# EAGLE design JDM2_2-Voltage_JmpConf_VDDctrl_LED (EAGLE 7.7.0)
JDM2 with selectable Dual-Voltage
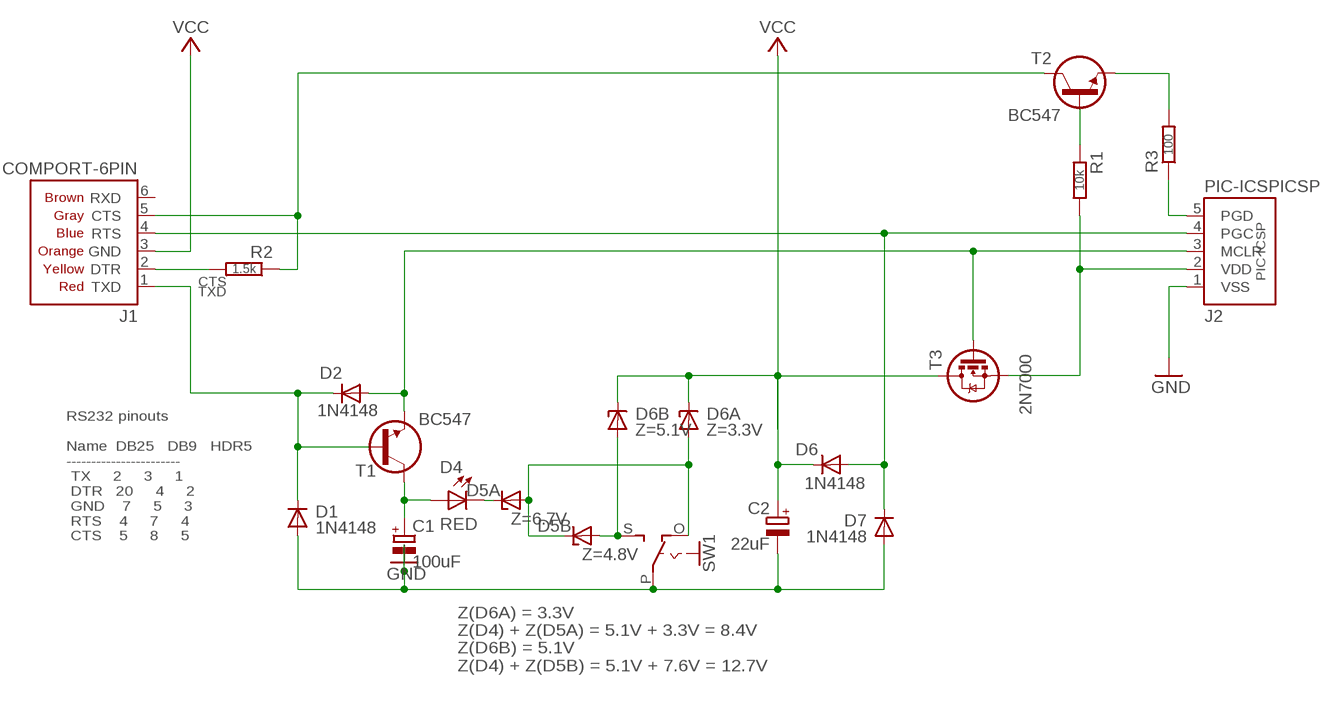
[diagram p0: schematic, sheet 1]

## Parts
C1  100uF  CPOLE2,5-5/V  [E2,5-5/V]
C2  22uF  CPOLE2,5-4/V  [E2.5-4/V]
D1  1N4148  1N414834-5  [DO34-5]
D2  1N4148  1N414834-5  [DO34-5]
D4  RED  TLLR4400  [LED3MM]
D5A  Z=6.7V  Z-DIODE34Z7  [DO34Z7]
D5B  Z=4.8V  Z-DIODE34Z7  [DO34Z7]
D6  1N4148  1N414834-10V  [DO34-10V]
D6A  Z=3.3V  Z-DIODE34Z7V  [DO34Z7V]
D6B  Z=5.1V  Z-DIODE34Z7V  [DO34Z7V]
D7  1N4148  1N414834-7V  [DO34-7V]
J1  COMPORT-6PIN  [RS232-6PIN]
J2  PIC-ICSPICSP  [PIC-ICSP]
R1  10k  R0202/7-V  [0202/7-V]
R2  1.5k  R0202/7-V  [0202/7-V]
R3  100  R0202/7  [0202/7]
SW1  SL-SW-1P-2T-JPSW  [JPSW-1P2T]
T1  BC547  BC547CBE  [TO92-CBE]
T2  BC547  BC547CBE  [TO92-CBE]
T3  2N7000  [TO92]

## Nets
/MCLR: D2.A J2.3(MCLR) T1.E T3.2(G)
CLK: D6.A D7.C J1.4(RTS) J2.4(PGC)
CTS: J1.5(CTS) R2.1 T2.C
DATA: R3.2 T2.E
GND: C1.- C2.- D1.A D7.A J2.1(VSS) SW1.P
N$1: R1.1 T2.B
N$3: D5B.A D6B.A SW1.S
N$4: D4.K(C) D5A.C
N$5: J2.2(VDD) R1.2 T3.1(S)
N$7: J1.2(DTR) R2.2
N$8: D5A.A D5B.C D6A.A SW1.O
PGD: J2.5(PGD) R3.1
TXD: D1.C D2.C J1.1(TXD) T1.B
VCC: C2.+ D6.C D6A.C D6B.C J1.3(GND) T3.3(D)
VPP: C1.+ D4.A T1.C
Unconnected: J1.6(RXD)

## Notes on the sheet
- RS232 pinouts
  
  Name  DB25   DB9   HDR5
  -----------------------
   TX     2     3     1
   DTR   20     4     2
   GND    7     5     3
   RTS    4     7     4
   CTS    5     8     5
- Z(D6A) = 3.3V
  Z(D4) + Z(D5A) = 5.1V + 3.3V = 8.4V
  Z(D6B) = 5.1V
  Z(D4) + Z(D5B) = 5.1V + 7.6V = 12.7V

## Library data of the parts
C1 C2 = c:CPOL: POLARIZED CAPACITOR, European symbol
D1 D2 D6 D7 = d:1N4148
D4 = led:TLLR4400: Low Current (2mA) LED 3 mm Tinted Diffused Package color RED Source: Data sheet <http://www.farnell.com/datasheets/391100.pdf>; MF: VISHAY SEMICONDUCTOR; OC_FARNELL: 1612437
D5A D5B D6A D6B = d:Z-DIODE
J1 = pinconn:COMPORT-6PIN
J2 = pinconn:PIC-ICSP
R1-R3 = r:R: RESISTOR, European symbol
SW1 = sw:SL-SW-1P-2T
T1 T2 = t:BC547
T3 = t:2N7000

## Net classes
0 default: width 0.559 mm
1 power: width 0.559 mm

## Board
JDM2 with selectable Dual-Voltage
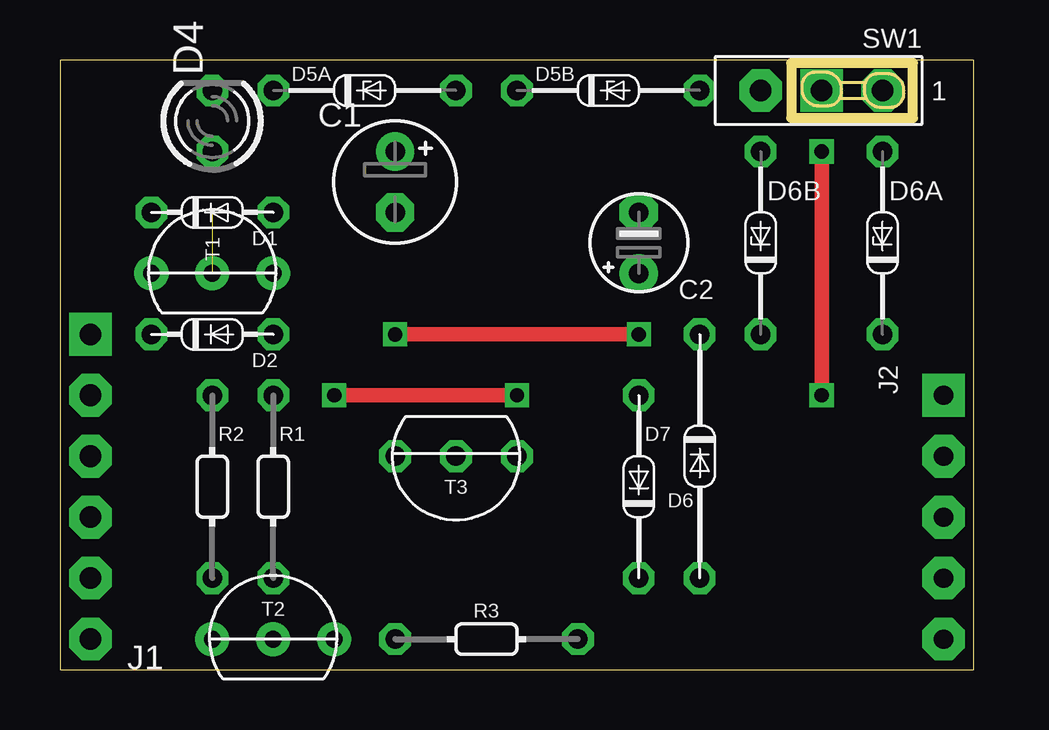
[diagram p1: board, top side]
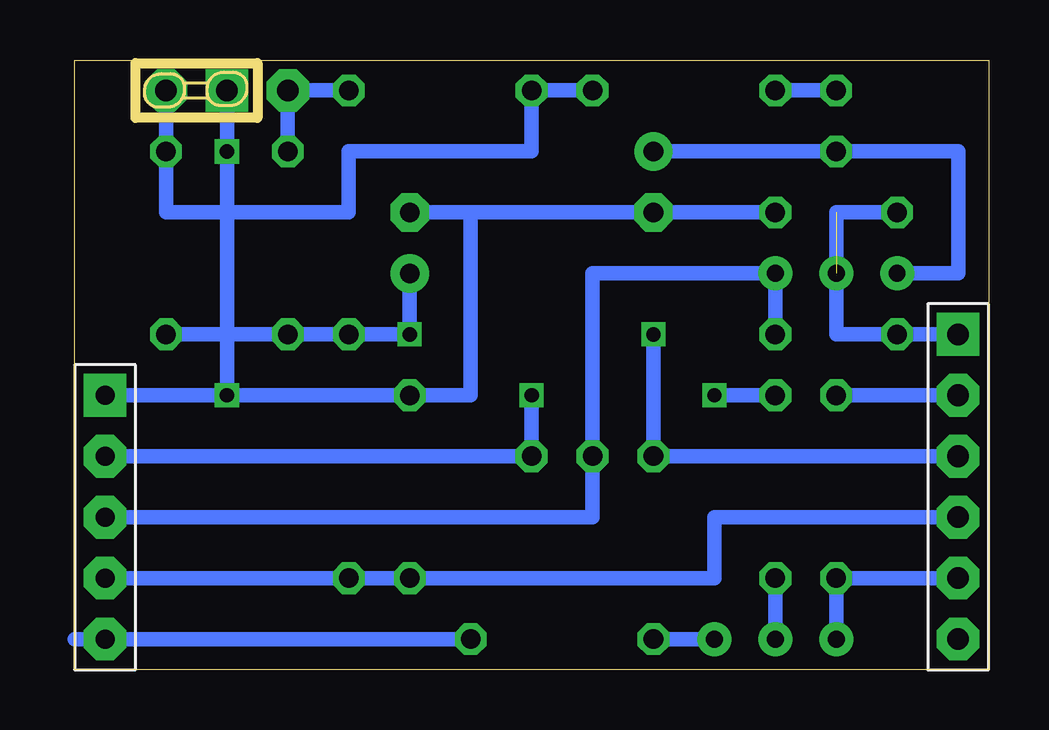
[diagram p2: board, bottom side, seen from below]

Size 38.1 x 25.4 mm. Coordinates in mm from the lower left corner, seen from the top.
Outline: 0,0 38.1,0 38.1,25.4 0,25.4 0,0
Copper layers (1*16): Top 0.035mm / dielectric 1.5mm / Bottom 0.035mm
Design rules "default": minimum track width 10mil, minimum drill 24mil, track to track 8mil, track to pad 8mil, pad to pad 8mil, via to via 8mil, smd to smd 8mil, copper to edge 40mil, drill to drill 8mil, minimum pad ring 10mil, minimum via ring 8mil, stop-mask expansion 4mil, vias tented up to drill 0mil, thermal gap 10mil

### Footprints (pad centres in the part's own frame; a part is rotated, then mirrored left to right if it is on the bottom)
E2,5-5/V = drill 0.813 pad 1.6: + 0,2.54 | drill 0.813 pad 1.6 octagon: - 0,0
E2.5-4/V = drill 0.813 pad 1.6: + 0,2.54 | drill 0.813 pad 1.6 octagon: - 0,0
DO34-5 = drill 0.813 octagon: A 2.54,0; C -2.54,0
LED3MM = drill 0.813 octagon: A -1.27,0; K 1.27,0
DO34Z7 = drill 0.813 octagon: A 3.81,0; C -3.81,0
DO34-10V = drill 0.813 octagon: A 0,5.08; C 0,-5.08
DO34Z7V = drill 0.813 octagon: A 0,3.81; C 0,-3.81
DO34-7V = drill 0.813 octagon: A 0,3.81; C 0,-3.81
RS232-6PIN = drill 0.9 pad 1.778 square: 1 0,0 | drill 0.9 pad 1.778 octagon: 2 0,2.54; 3 0,5.08; 4 0,7.62; 5 0,10.16; 6 0,12.7
PIC-ICSP = drill 0.8 pad 1.778 square: 1 0,0 | drill 0.8 pad 1.778 octagon: 2 2.54,0; 3 5.08,0; 4 7.62,0; 5 10.16,0
0202/7-V = drill 0.813 octagon: 1 0,-3.81; 2 0,3.81
0202/7 = drill 0.813 octagon: 1 -3.81,0; 2 3.81,0
JPSW-1P2T = drill 0.9 pad 1.778 octagon: O -2.54,0; S 2.54,0 | drill 0.9 pad 1.778 square: P 0,0
TO92-CBE = drill 0.7 pad 1.422: B 0,0; C 0,2.54; E 0,-2.54
TO92 = drill 0.813 octagon: 1 -2.54,0; 2 0,0; 3 2.54,0

### Placement (x,y rotation side)
C1  13.97,19.05 0 top
C2  24.13,19.05 180 top
D1  6.35,19.05 0 top
D2  6.35,13.97 0 top
D4  6.35,22.86 90 top
D5A  12.7,24.13 0 top
D5B  22.86,24.13 0 top
D6  26.67,8.89 180 top
D6A  34.29,17.78 0 top
D6B  29.21,17.78 0 top
D7  24.13,7.62 0 top
J1  1.27,13.97 180 top
J2  36.83,11.43 270 top
R1  8.89,7.62 0 top
R2  6.35,7.62 0 top
R3  17.78,1.27 180 top
SW1  31.75,24.13 180 top
T1  6.35,16.51 90 top
T2  8.89,1.27 90 top
T3  16.51,8.89 180 top

### Tracks (layer width: path | path; a pad name or v marks a point on that pad's centre or on a via)
/MCLR
  Bottom 0.61: D2.A T1.E 16.51,16.51 T3.2 16.51,6.35 J2.3
CLK
  Bottom 0.61: J1.4 11.43,6.35 11.43,3.81 D7.C D6.A J2.4
CTS
  Bottom 0.61: J1.5 R2.1 T2.C
DATA
  Bottom 0.61: T2.E R3.2
GND  (via drill 0.6)
  Top 0.61: v31.75,11.43 v31.75,21.59
  Bottom 0.61: D1.A C1.- C2.- 21.59,19.05 21.59,11.43 D7.A v31.75,11.43 | J2.1 v31.75,11.43 | SW1.P v31.75,21.59 v31.75,11.43
N$1
  Bottom 0.61: T2.B R1.1
N$3
  Bottom 0.61: D6B.A SW1.S D5B.A
N$4
  Bottom 0.61: D5A.C D4.K
N$5  (via drill 0.6)
  Top 0.61: v11.43,11.43 v19.05,11.43
  Bottom 0.61: R1.2 v11.43,11.43 | v19.05,11.43 T3.1 J2.2
N$7
  Bottom 0.61: R2.2 J1.2
N$8
  Bottom 0.61: SW1.O D6A.A 34.29,19.05 26.67,19.05 26.67,21.59 19.05,21.59 D5B.C D5A.A
PGD
  Bottom 0.61: R3.1 J2.5 38.1,1.27
TXD  (1 unrouted)
  Bottom 0.61: D1.C 6.35,19.05 6.35,13.97 D2.C J1.1
VCC  (via drill 0.6)
  Top 0.61: v13.97,13.97 v24.13,13.97
  Bottom 0.61: J1.3 T3.3 v13.97,13.97 | C2.+ v24.13,13.97 D6.C D6B.C D6A.C
  other vias: 24.13,16.51
VPP
  Bottom 0.61: C1.+ D4.A 1.27,21.59 1.27,16.51 T1.C

### Text on the board
Dimension: 10 | 9 | 8 | 7 | 6 | 5 | 4 | 3 | 2 | 1 | 1 | 2 | 3 | 4 | 5 | 6 | 7 | 8 | 9 | 10 | 11 | 12 | 13 | 14 | 15